# Altium project StepCounter_sensor.PrjPcb
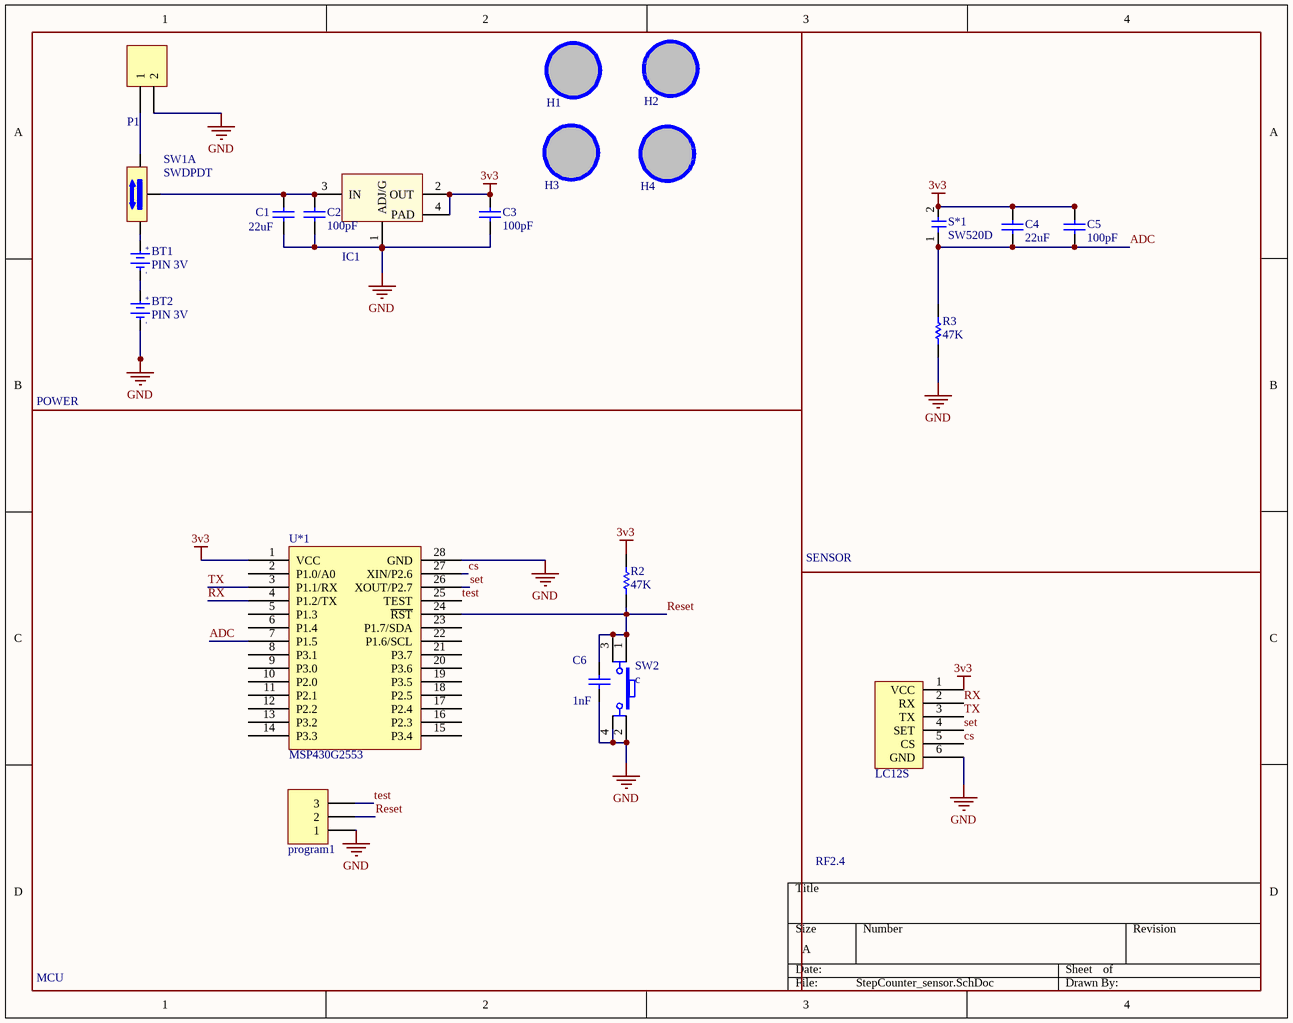
[diagram p0: StepCounter_sensor.SchDoc]
1 sheet, 22 parts. Net scope: global (net labels, ports and power ports of the same name join across sheets).
Board file: StepCounter_sensor.PcbDoc

## Sheet StepCounter_sensor.SchDoc
size A

### Parts
BT1  PIN 3V  [PIN3V]
BT2  PIN 3V  [PIN3V]
C1  value 22uF  [CAP-SM-0805]  (hidden comment: Cap Non-Pol SMD)
C2  value 100pF  [CAP-SM-0805]  (hidden comment: Cap Non-Pol SMD)
C3  value 100pF  [CAP-SM-0805]  (hidden comment: Cap Non-Pol SMD)
C4  value 22uF  [CAP-SM-0603]  (hidden comment: Cap Non-Pol SMD)
C5  value 100pF  [CAP-SM-0603]  (hidden comment: Cap Non-Pol SMD)
C6  value 1nF  [CAP-SM-0603]  (hidden comment: Cap Non-Pol SMD)
H1  Hole  [LO KHOAN 3MM]  (value not drawn)
H2  Hole  [LO KHOAN 3MM]  (value not drawn)
H3  Hole  [LO KHOAN 3MM]  (value not drawn)
H4  Hole  [LO KHOAN 3MM]  (value not drawn)
IC1  LM1117  [SOT223-4N]  (value not drawn)
P1  Header 2  [JP2]  (value not drawn)
program1  Header 3  [JP3]  (value not drawn)
R2  value 47K  [RES-SM-0603]  (hidden comment: RESISTOR SMD)
R3  value 47K  [RES-SM-0603]  (hidden comment: RESISTOR SMD)
RF*1  LC12S  [JP6]
S*1  SW520D  [CP1/2]
SW1  SWDPDT  [SWDPDT_1.5x1]  (part A of 2)
SW2  c  [SW4]
U*1  MSP430G2553  [msp430g2553tsstop]

### Blocks framed on the sheet
POWER: BT1 BT2 C1-C3 H1-H4 IC1 P1 SW1
SENSOR: C4 C5 R3 S*1
MCU: C6 program1 R2 SW2 U*1

### Nets
3v3: C3.1 C4.2 C5.2 IC1.2(OUT) IC1.4(PAD) R2.1 RF*1.1(VCC) S*1.2 U*1.1(VCC)
GND: BT2.2(GND) C1.1 C2.1 C3.2 C6.2 IC1.1(ADJ/G) P1.2 program1.1 R3.1 RF*1.6(GND) SW2.2 SW2.4 U*1.28(GND)
ADC: C4.1 C5.1 R3.2 S*1.1 U*1.7(P1.5)
cs: RF*1.5(CS) U*1.27(XIN/P2.6)
Reset: C6.1 program1.2 R2.2 SW2.1 SW2.3 U*1.24(~{RST})
RX: RF*1.2(RX) U*1.4(P1.2/TX)
set: RF*1.4(SET) U*1.26(XOUT/P2.7)
test: program1.3 U*1.25(TEST)
TX: RF*1.3(TX) U*1.3(P1.1/RX)
NetBT1_1: BT1.1(+3V) SW1.1
NetBT1_2: BT1.2(GND) BT2.1(+3V)
NetC1_2: C1.2 C2.2 IC1.3(IN) SW1.2
NetP1_1: P1.1 SW1.3

Not connected (* = marked no-connect by the designer): H1 1; H2 1; H3 1; H4 1; U*1 2(P1.0/A0) 5(P1.3) 6(P1.4) 8(P3.1) 9(P3.0) 10(P2.0) 11(P2.1) 12(P2.2) 13(P3.2) 14(P3.3) 15(P3.4) 16(P2.3) 17(P2.4) 18(P2.5) 19(P3.5) 20(P3.6) 21(P3.7) 22(P1.6/SCL) 23(P1.7/SDA)

### Notes on the sheet
- RF2.4
- (in symbol PIN 3V) +; -

### Library data of the parts
BT1 BT2 = PIN 3V: Battery 3VDC; Value: PIN 3V
C1-C6 = Cap Non-Pol SMD: Capacitor
H1-H4 = Hole: Hole 3mm
IC1 = LM1117: Available in 1.8V, 2.5V, 2.85V, 3.3V, 5V, and  Adjustable Versions; Value: LM317
P1 = Header 2: Header, 2-Pin; LatestRevisionDate: 17-Jul-2002; LatestRevisionNote: Re-released for DXP Platform.; Publisher: Altium Limited
program1 = Header 3: Header, 3-Pin; LatestRevisionDate: 17-Jul-2002; LatestRevisionNote: Re-released for DXP Platform.; Publisher: Altium Limited
R2 R3 = RESISTOR SMD: Resistor
SW1 = SWDPDT: Switch SPDT; Creat by: VanDungEvn@Gmail.com
SW2 = SW4: Switch button 4 pin; Value: Button chip 4 pin